# EAGLE schematic detector-opamp (EAGLE 7.6.0)
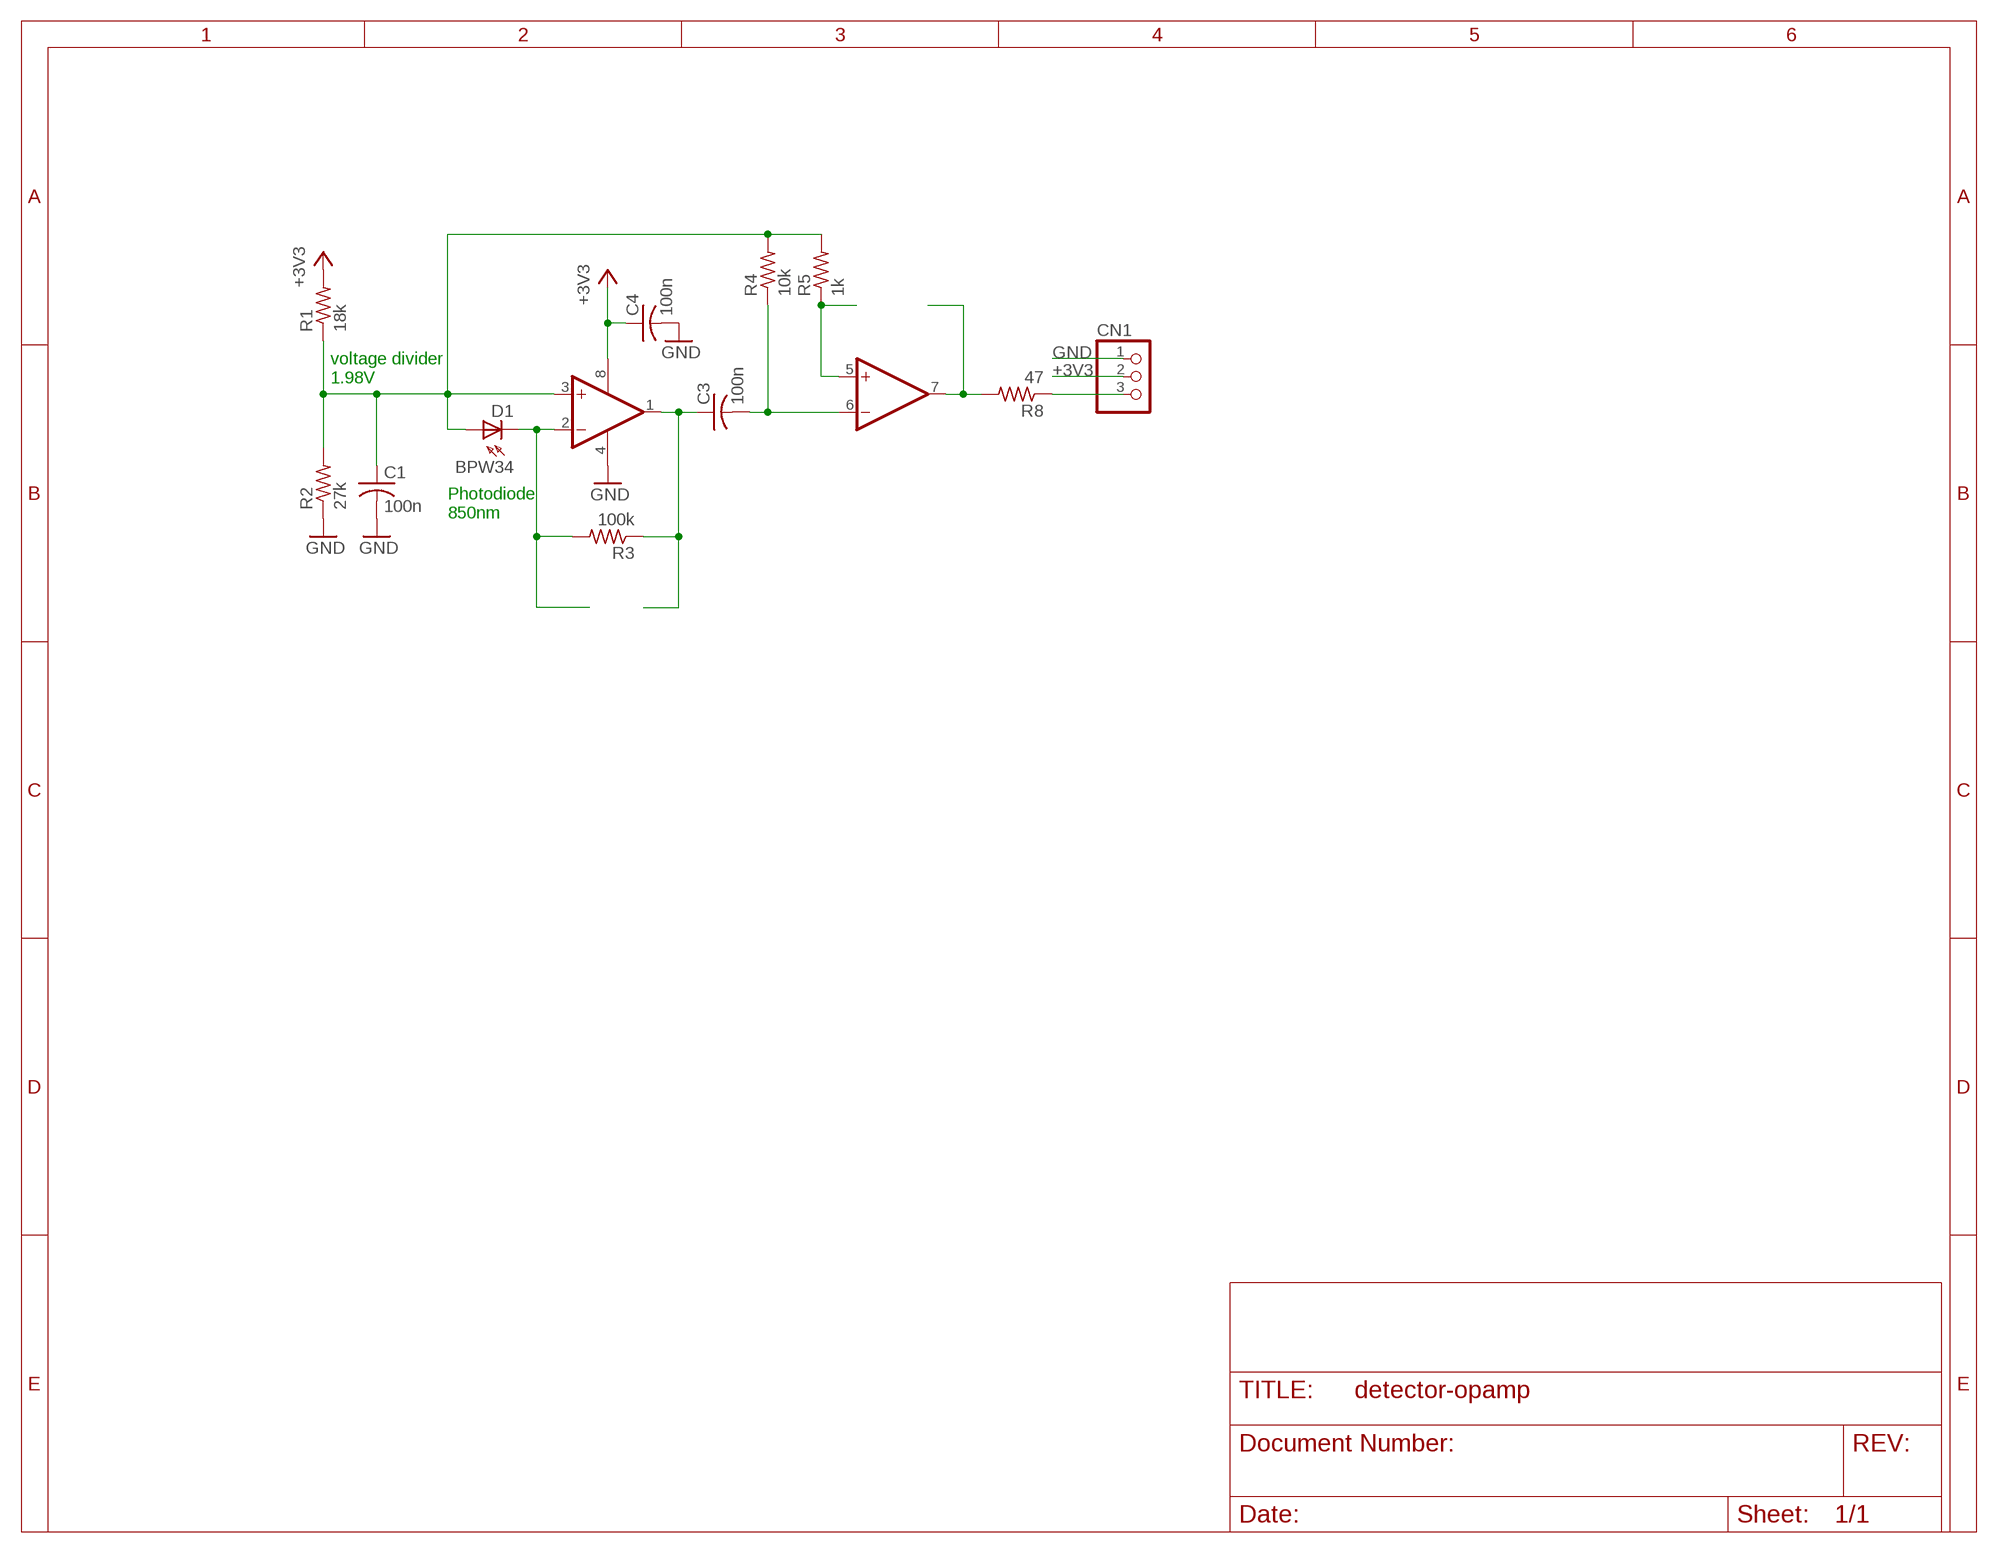
[diagram p0: schematic, sheet 1]

## Parts
C1  100n  C-USC0603K  [C0603K]
C3  100n  C-USC0603K  [C0603K]
C4  100n  C-USC0603K  [C0603K]
CN1  JST_3PIN  [JSTPH3]
D1  BPW34  BPW32  [BPW32]
IC1  OPA2725D  [SO08]
R1  18k  R-US_R0402  [R0402]
R2  27k  R-US_R0402  [R0402]
R3  100k  R-US_R0402  [R0402]
R4  10k  R-US_R0402  [R0402]
R5  1k  R-US_R0402  [R0402]
R8  47  R-US_R0402  [R0402]

## Nets
+3V3: C4.1 CN1.2 IC1.8(P:V+) R1.2
GND: C1.2 C4.2 CN1.1 IC1.4(P:V-) R2.1
N$1: C1.1 D1.A IC1.3(A:+IN) R1.1 R2.2 R4.2 R5.2
N$2: C3.1 IC1.1(A:OUT) R3.1
N$3: D1.K(C) IC1.2(A:-IN) R3.2
N$5: C3.2 IC1.6(B:-IN) R4.1
N$6: IC1.5(B:+IN) R5.1
N$7: IC1.7(B:OUT) R8.2
N$9: CN1.3 R8.1

## Notes on the sheet
- voltage divider
  1.98V
- Photodiode
  850nm

## Library data of the parts
C1 C3 C4 = adafruit:C-US: CAPACITOR, American symbol
CN1 = adafruit:JST_3PIN
D1 = opto-trans-siemens:BPW32: PHOTO DIODE; OC_FARNELL: unknown; OC_NEWARK: unknown
IC1 = linear:OPA2725: Very Low Noise, High-Speed, 12V CMOS Operational Amplifier Source: http://focus.ti.com/lit/ds/symlink/opa725.pdf
R1-R5 R8 = adafruit:R-US_: RESISTOR, American symbol